# Altium schematic sheet 2019_Box_MainBoard_sch.SchDoc
size A3
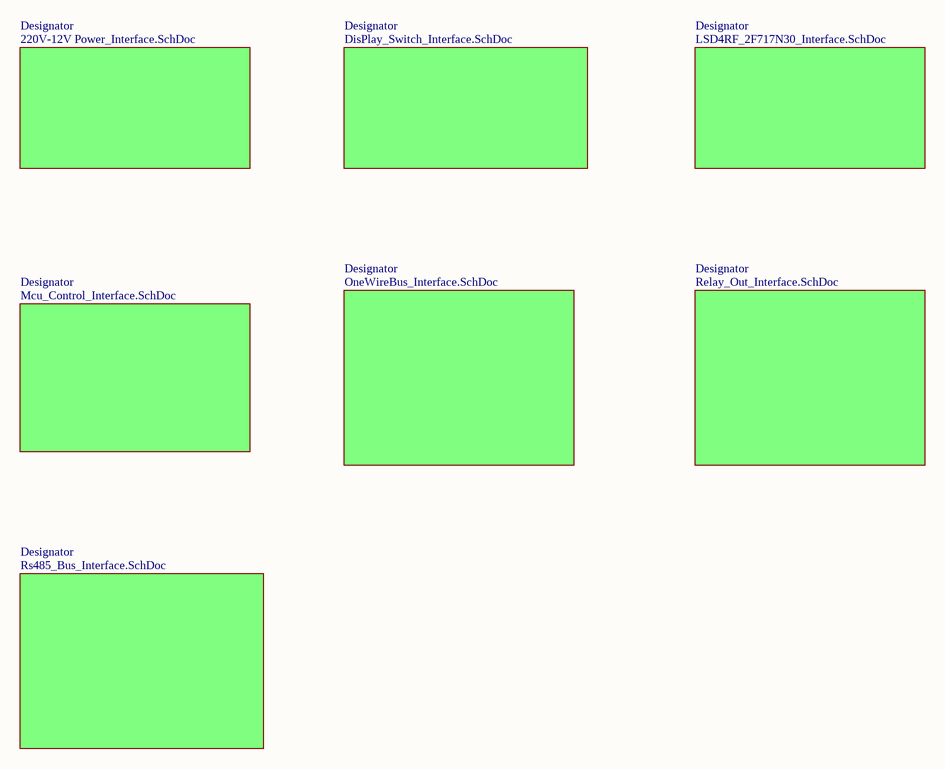
[diagram p0: 2019_Box_MainBoard_sch.SchDoc]

## Sub-sheets
Designator = 220V-12V Power_Interface.SchDoc: no entries
Designator = DisPlay_Switch_Interface.SchDoc: no entries
Designator = LSD4RF_2F717N30_Interface.SchDoc: no entries
Designator = Mcu_Control_Interface.SchDoc: no entries
Designator = OneWireBus_Interface.SchDoc: no entries
Designator = Relay_Out_Interface.SchDoc: no entries
Designator = Rs485_Bus_Interface.SchDoc: no entries